# Altium schematic sheet Debug_Leds.SchDoc
size A4; SheetNumber: 11; SheetTotal: 13
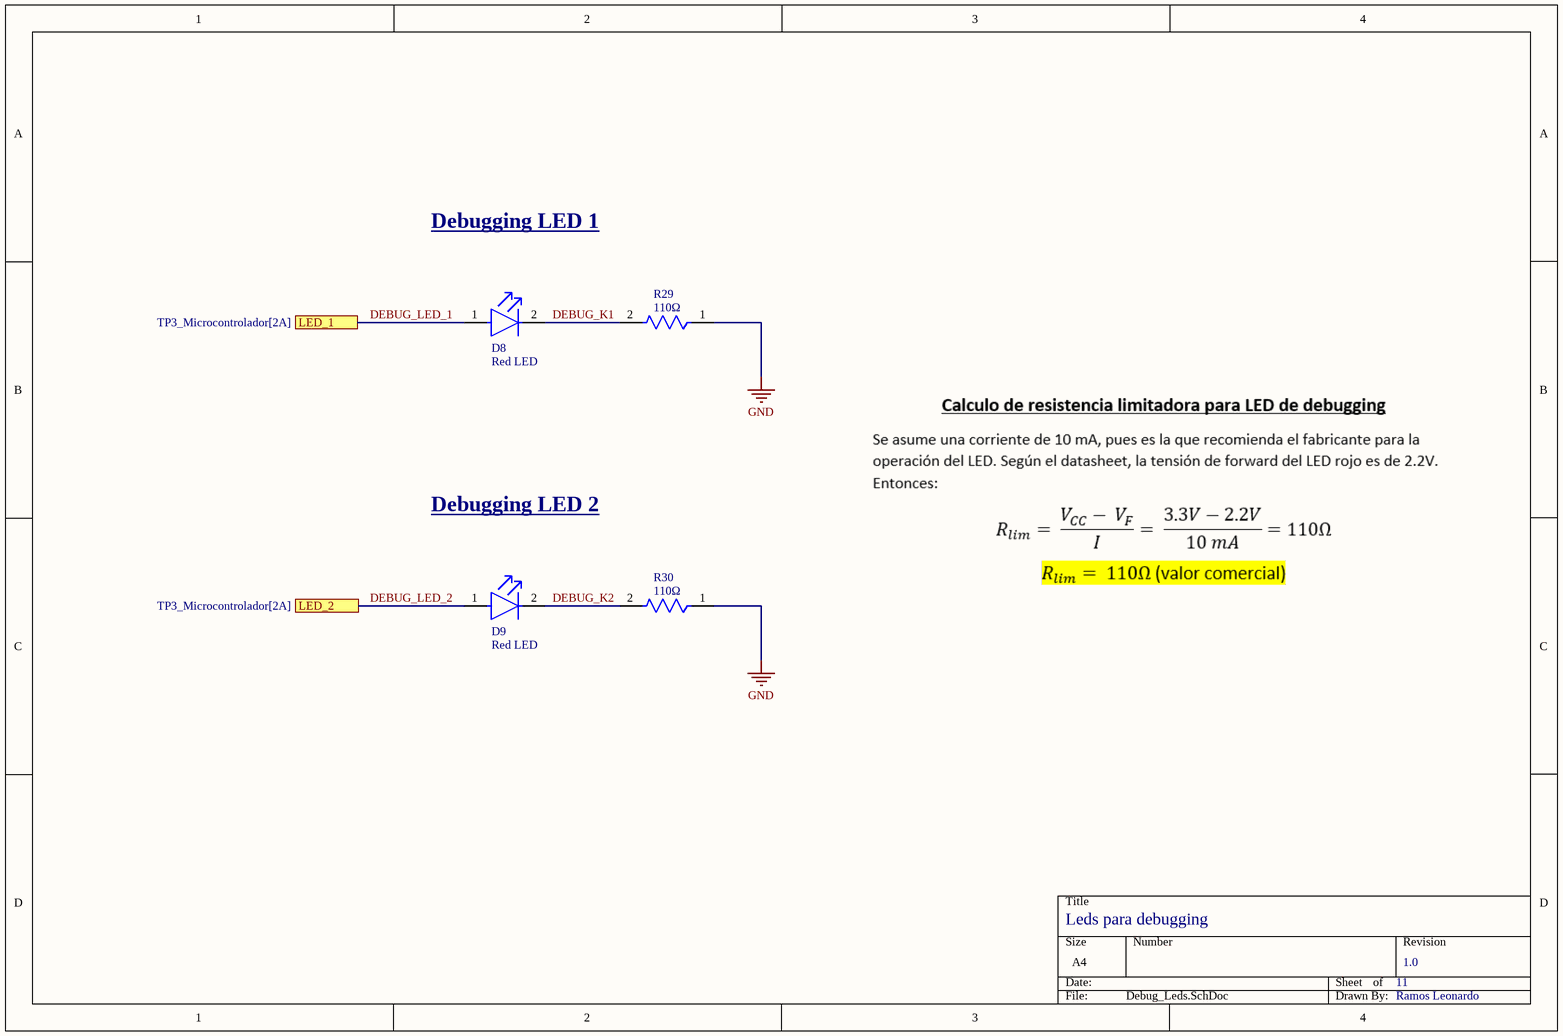
[diagram p0: Debug_Leds.SchDoc]

## Parts
D8  Red LED  [FP-SML-LX0805SRC-TR-MFG]
D9  Red LED  [FP-SML-LX0805SRC-TR-MFG]
R29  Resistance: 110Ω  [FP-CRCW0805-e3-IPC_B]  (hidden comment: CRCW08054K70JNEA)
R30  Resistance: 110Ω  [FP-CRCW0805-e3-IPC_B]  (hidden comment: CRCW08054K70JNEA)

## Ports
LED_1 (see TP3_Microcontrolador[2A]), LED_2 (see TP3_Microcontrolador[2A])

## Nets
GND: R29.1 R30.1
DEBUG_K1: D8.2(C) R29.2
DEBUG_K2: D9.2(C) R30.2
DEBUG_LED_1: D8.1(A) ; port LED_1
DEBUG_LED_2: D9.1(A) ; port LED_2

## Notes on the sheet
- Debugging LED 1
- Debugging LED 2
- Leds para debugging
- 11
- 1.0
- Ramos Leonardo

## Library data of the parts
D8 D9 = CMP-57192-000013-1: LED RED CLEAR SMD SML-LX0805SRC-TR; Forward Current: 20mA; Wavelength: 660nm; Forward Voltage: 1.7V; Luminous Intensity: 25mcd; Number of LEDs: 1; Current Rating: 25mA; Lens Color: Colorless; Power Rating: 100mW; Viewing Angle: 140°; Approvals: UL; Lens Transparency: Clear; Series: -; Package Quantity: 3000; Mount: Surface Mount; Lead Free: Lead Free; Case/Package: 0805; Max Operating Temperature: 85°C; Illumination Color: Red; Packaging: Tape and Reel; Length: 2mm; Lens Style: Clear; Width: 1.25mm; RoHS Compliant: Yes; Color: Red; Case Code (Metric): 2012; Dominant Wavelength: 660nm; Number of Pins: 2; Min Operating Temperature: -40°C; Case Code (Imperial): 0805; Voltage Rating (DC): 1.7V; Voltage Rating: 1.7V; Height: 1.2mm; Test Current: 20mA
R29 R30 = CMP-2001-03967-2: RES Thick Film, 5%, 0.125W, 200ppm/°C, 0805; Power Rating: 125mW; Voltage Rating: 150V; Radiation Hardening: No; Case Code (Imperial): 0805; Military Standard: Not; Contact Plating: Tin; Weight: 0.000194oz; Mount: Surface Mount; Termination: SMD/SMT; Packaging: Tape and Reel; Min Operating Temperature: -55°C; Width: 1.25mm; Tolerance: 5%; Height: 0.45mm; Depth: 1.25mm; Length: 2mm; Temperature Coefficient: 200ppm/°C; Case Code (Metric): 2012; Package Quantity: 5000; Max Operating Temperature: 155°C; Case/Package: 0805; Composition: Thick Film